# Altium schematic sheet 2V_AUX.SchDoc
size A4; SheetNumber: 6; SheetTotal: 8
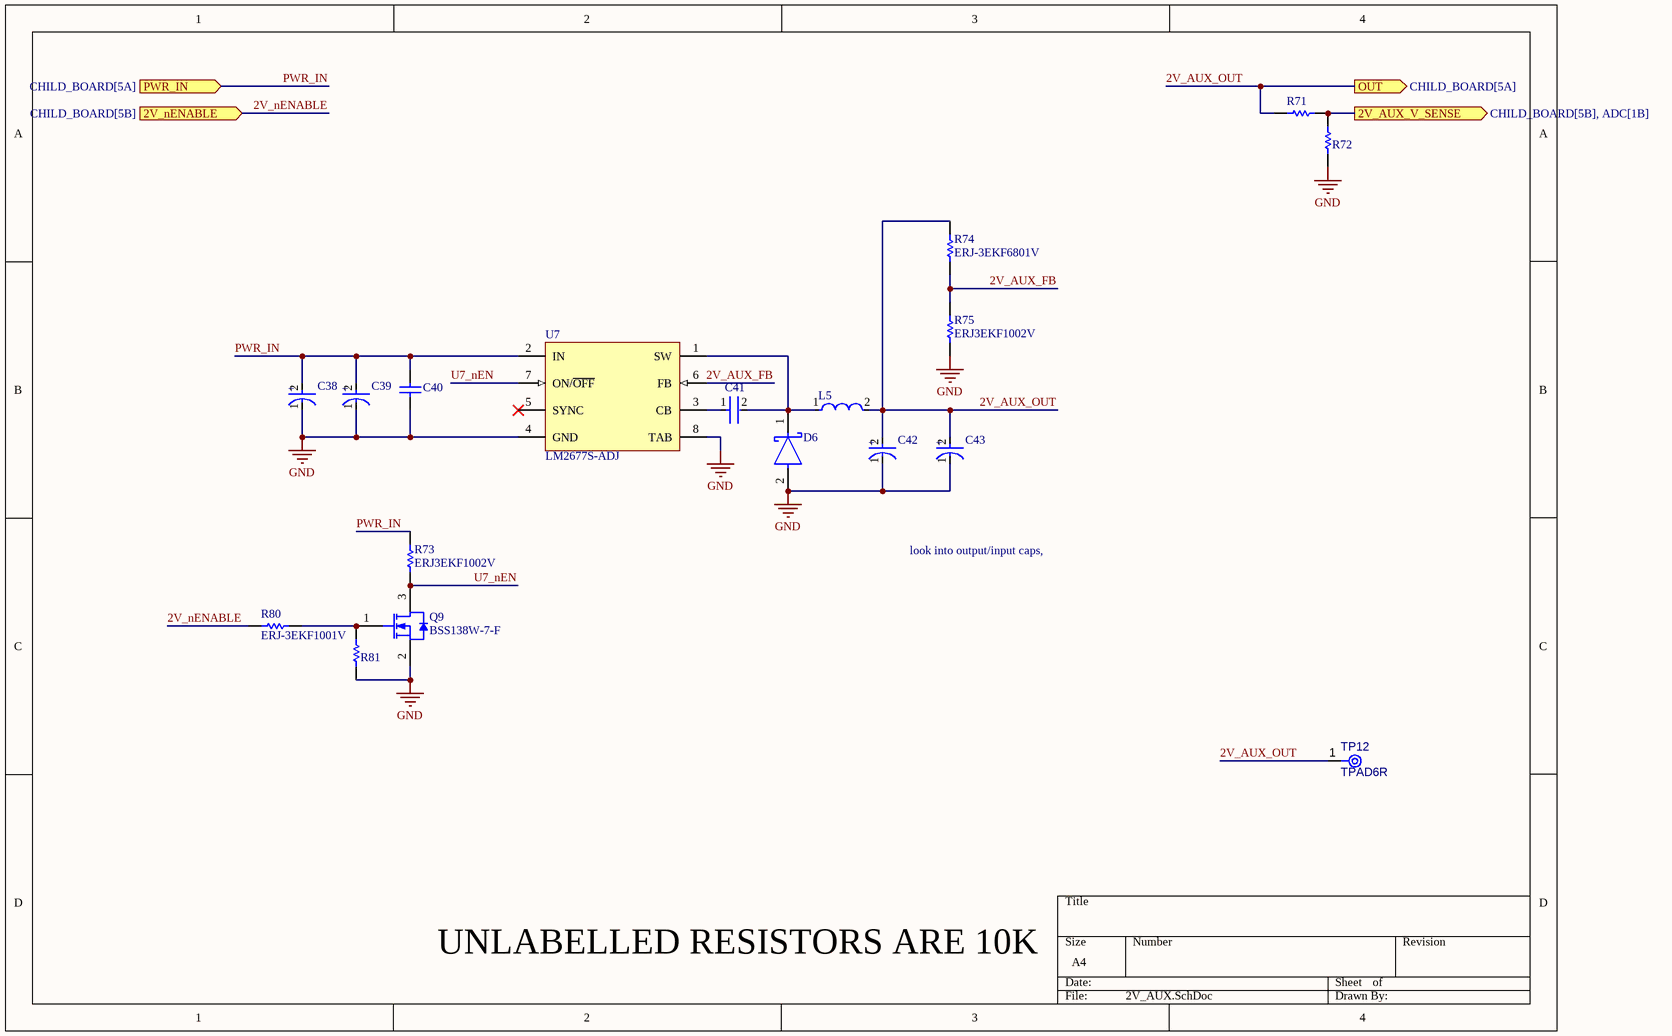
[diagram p0: 2V_AUX.SchDoc]

## Parts
C38  EEHZA1V680XP  [FP-EEH-D8-MFG]  (value not drawn)
C39  EEHZA1V680XP  [FP-EEH-D8-MFG]  (value not drawn)
C40  CAP 470nF 50V 1812(4532)  [CAPC1812(4532)125_M]  (value not drawn)
C41  C0805C103J5RACTU  [FP-C0805C-DN-MFG]  (value not drawn)
C42  16SVPC120M  [FP-OS-CON-SMT-E7-MFG]  (value not drawn)
C43  16SVPC120M  [FP-OS-CON-SMT-E7-MFG]  (value not drawn)
D6  B540C-13-F  [FP-SMC-MFG]  (value not drawn)
L5  SRR1260-150M  [FP-SRR1260-MFG]  (value not drawn)
Q9  BSS138W-7-F  [DIOD-SOT323-3_V]
R71  ERJ3EKF1002V  [RESC1609X55X30LL15T15]  (value not drawn)
R72  ERJ3EKF1002V  [RESC1609X55X30LL15T15]  (value not drawn)
R73  ERJ3EKF1002V  [RESC1609X55X30LL15T15]
R74  ERJ-3EKF6801V  [RESC1609X55X30NL15T15]
R75  ERJ3EKF1002V  [RESC1609X55X30LL15T15]
R80  ERJ-3EKF1001V  [RESC1608X55X30LL15T15]
R81  ERJ3EKF1002V  [RESC1609X55X30LL15T15]  (value not drawn)
TP12  TPAD6R  [TP06R]  (no BOM)
U7  LM2677S-ADJ  [KTW0007B_M]

## Ports
2V_AUX_V_SENSE (out, see CHILD_BOARD[5B], ADC[1B]), 2V_nENABLE (in, see CHILD_BOARD[5B]), OUT (out, see CHILD_BOARD[5A]), PWR_IN (in, see CHILD_BOARD[5A])

## Nets
GND: C38.1(C) C39.1(C) C40.1 C42.1(C) C43.1(C) D6.2(A) Q9.2(S) R72.1 R75.1 R81.1 U7.4(GND) U7.8(TAB)
2V_AUX_FB: R74.1 R75.2 U7.6(FB)
2V_AUX_OUT: C42.2(A) C43.2(A) L5.2 R71.1 R74.2 TP12.1(TP) ; port OUT
2V_AUX_V_SENSE: R71.2 R72.2 ; port 2V_AUX_V_SENSE
2V_nENABLE: R80.1 ; port 2V_nENABLE
PWR_IN: C38.2(A) C39.2(A) C40.2 R73.2 U7.2(IN) ; port PWR_IN
U7_nEN: Q9.3(D) R73.1 U7.7(ON/~{OFF})
NetC41_1: C41.1 U7.3(CB)
NetC41_2: C41.2 D6.1(C) L5.1 U7.1(SW)
NetQ9_1: Q9.1(G) R80.2 R81.2

Not connected (* = marked no-connect by the designer): U7 5(SYNC)*

## Notes on the sheet
- look into output/input caps,
- UNLABELLED RESISTORS ARE 10K
- (in symbol CMP-05428-000021-2) +
- (in symbol CMP-05428-001211-1) +

## Library data of the parts
C38 C39 = CMP-05428-001211-1: Conductive Polymer Hybrid Aluminum Electrolytic Capacitors 68uF ±20% 35V RADIAL SMT 6.3x7.7mm; Leakage Current: 23.8uA; Ripple Current (AC): 2A; Polarity: Polar; Life (Hours): 5000Hour; ESR (Equivalent Series Resistance): 35mR; Lead Diameter: 0.65mm; Termination: SMD/SMT; Case/Package: Radial; Package Quantity: 900; Radiation Hardening: No; Max Operating Temperature: 105°C; Capacitance: 68uF; Voltage Rating: 35V; Number of Pins: 8; Mount: Surface Mount; Technology: HYBRID; Diameter: 6.3mm; Min Operating Temperature: -55°C; Length: 7.7mm; Ratings: AEC-Q200; Height - Seated (Max): 0.315inch; Ripple Current: 2A; Lead Free: Lead Free; Voltage: 35V; Lead Pitch: 1.8mm; Voltage Rating (DC): 35V; REACH SVHC: No SVHC; Material: Polymer; Height: 7.7mm; Tolerance: 20%; Construction: Cylindrical; Packaging: Tape and Reel; Series: ZA
C40 = CMP-1040-01539-1: CAP 470nF 50V ±10% 1812 (4532 Metric) Thickness 1.25mm SMD; Tolerance: Â±10%; Case-Metric: 4532; Case-EIA: 1812; Technology: SMT; Max Thickness: 1.25 mm; Value: 470nF; Rated Voltage: 50 V
C41 = CMP-2007-00254-2: CAP CER 10000PF 50V X7R 0805; Manufacturer: KEMET; Value: 10,000 pF; Material: Ceramic; Temperature Coefficient: 30ppm/°C; Tolerance: 0.05; Device Class L1: Passive Components; Temperature: -55°C to +125°C; Lead Free: Yes; ComponentLink2URL: https://content.kemet.com/datasheets/KEM_C1003_C0G_SMD.pdf; Device Class L3: Ceramic Capacitors; Temperature Characteristic: X7R; Temperature Range High: +125°C; Mouser Description: Capacitor; Ceramic; Cap 0.01uF; Tol 5%; Vol-Rtg 50 V; SMT; Case 0805; X7R; TR; ComponentLink2Description: Datasheet; Manufacturer Part Number: C0805C103J5RACTU; Height: 0.88mm; Digikey Description: CAP CER 10000PF 50V X7R 0805; Capacitance: 10,000 pF; Temperature Range Low: -55°C; Device Class L2: Capacitors; Octopart: https://octopart.com/c0805c103j5ractu-kemet-133473; Voltage Rating: 50 V; Category: Cap; RoHS: TRUE; Automotive: No; Package: C0805C-DN; Ipc Land Pattern Name: CAPC200125X78
C42 C43 = CMP-05428-000021-2: Conductive Polymer Aluminum Solid Capacitors (OS-CON) 120uF ±20% 16V RADIAL SMT 8x6.9mm; Leakage Current: 500uA; Ripple Current: 2.9A; ESR (Equivalent Series Resistance): 27mR; Polarity: Polar; Dissipation Factor: 12%; Life (Hours): 2000Hour; Lead Free: Lead Free; Voltage Rating (DC): 16V; Min Operating Temperature: -55°C; Height - Seated (Max): 0.276inch; Case/Package: Radial; REACH SVHC: No SVHC; Diameter: 8mm; Mount: Surface Mount; Package Quantity: 1000; Construction: Cylindrical; Max Operating Temperature: 105°C; Capacitance: 120uF; Voltage: 16V; Length: 6.9mm; Tolerance: 20%; RoHS Compliant: Yes; Series: OS-CON, SVPC; Packaging: Tape and Reel; Voltage Rating: 16V; Termination: SMD/SMT; Number of Pins: 7; Ripple Current (AC): 2.9A; Height: 6.9mm
D6 = CMP-2000-05097-3: DIODE SCHOTTKY 40V 5A SMC; Manufacturer: Diodes Inc.; Automotive Grade: NA; Peak Reverse Current: 0.5mA; Value: 300pF; Max Junction Temp: +150°C; Max Surge Forward Current: 100A; Standoff Height: 0.1mm; Digikey Description: DIODE SCHOTTKY 40V 5A SMC; Temperature Range Low: -55°C; Manufacturer Part Number: B540C-13-F; Octopart: https://octopart.com/b540c-13-f-diodes+inc.-325873; Lead Free: Yes; Reverse Voltage: 40V; RoHS: TRUE; Category: Diode; Mouser Description: Diode: Schottky rectifying; SMD; 40V; 5A; SMC; Package: reel, tape; ComponentLink2Description: Datasheet; Temperature Range High: +150°C; Automotive: No; Footprint Url: https://www.diodes.com/assets/Package-Files/SMC.pdf; Device Class L3: Schottky Diodes; Height: 2.5mm; Forward Current: 5A; Temperature: -55°C to +150°C; Package: SMC; ComponentLink2URL: https://www.diodes.com/assets/Datasheets/ds13012.pdf; Device Class L2: Diodes; Max Repetitive Reverse Voltage: 40V; Device Class L1: Discrete Semiconductors; Capacitance: 300pF
L5 = CMP-2000-07146-2: FIXED IND 15UH 5A 27 MOHM SMD; Q Factor: 25; Sample Rate (Hz): 100kHz; Resistance: 27MR; Material: Steel; Inductance Tolerance: 20%; Frequency: 17.6MHz; Saturation Current: 4.6A; Core Material: Ferrite; Shielding: Shielded; Series: SRR1260; Termination: SMD/SMT; Packaging: Tape and Reel; RoHS Compliant: Yes; Height - Seated (Max): 0.256inch; Depth: 12.8mm; Case/Package: 1260; Inductance: 15uH; Height: 6mm; Number of Pins: 2; Mount: Surface Mount; Min Operating Temperature: -40°C; Test Frequency: 100kHz; Length: 12.5mm; Self Resonant Frequency: 17.6MHz; Current Rating: 5A; Tolerance: 20%; RMS Current (Irms): 5A; REACH SVHC: No SVHC; Resistor Type: Wirewound; DC Resistance (DCR): 27mR; Width: 12.5mm; Package Quantity: 600; DC Current: 5A; Max DC Current: 5A; Max Operating Temperature: 125°C; Military Standard: Not
Q9 = CMP-2000-05968-1: N-Channel Enhancement Mode Mosfet, 50 V, 200 mA, -55 to 150 degC, 6-Pin SOT-323, RoHS, Tape and Reel; Typical Turn-Off Delay Time: 20ns; Number of Channels: 1Channel; Type: EnhancementModeFieldEffectTransistor; Brand: DiodesIncorporated; Vds - Drain-Source Breakdown Voltage: 75V; Vgs - Gate-Source Voltage: 20V; Rds On - Drain-Source Resistance: 1.4Ohms; Transistor Type: 1N-Channel; Configuration: Single; Unit Weight: 0.000212oz; Pd - Power Dissipation: 200mW; Id - Continuous Drain Current: 200mA; Forward Transconductance - Min: 0.1S; Manufacturer URL: http://www.diodes.com/; Series: BSS138; Package Description: 3-Pin Small Outline Transistor, Body 2 x 1.25 mm, Pitch 0.65 mm; Mounting Technology: SurfaceMount; Product Category: MOSFET; RoHS: True; Maximum Operating Temperature: +150C; Height: 1mm; Length: 2.2mm; Technology: Si; Width: 1.35mm; Datasheet URL: http://www.diodes.com/_files/datasheets/ds30206.pdf; Manufacturer: DiodesIncorporated; Package / Case: SOT-323-3; Typical Turn-On Delay Time: 20ns; Transistor Polarity: N-Channel; Factory Pack Quantity: 3000; Packaging: Reel; Product: MOSFETSmallSignal; Datasheet Version: Rev. 11-2, 09/2013; Package Reference: SOT323; Minimum Operating Temperature: -55C; Mounting Style: SMD/SMT; Channel Mode: Enhancement
R71-R73 R75 R81 = CMP-1012-00623-3: Chip Resistor, 10 KOhm, +/- 1%, 0.1 W, -55 to 155 degC, 0603 (1608 Metric), RoHS, Tape and Reel; Manufacturer: Panasonic; Voltage Rating: 75V; Case\/Package: 0603; Power Rating: 100mW; Resistance: 10KOhm; Temperature Coefficient: 100ppm\/degreesC; Number of Pins: 2; Package Reference: 603; Depth: 0.8mm; Mount: SurfaceMount; Package Description: 2-Pin Surface Mount Device, Body 1.6 x 0.85 mm; Datasheet Version: 02/2017; Length: 1.6mm; Lead Free: LeadFree; Height: 0.45mm; Number of Terminations: 2; Max Power Dissipation: 100mW; Min Operating Temperature: -55degC; Datasheet URL: https://industrial.panasonic.com/cdbs/www-data/pdf/RDA0000/AOA0000C304.pdf; Termination: SMD/SMT; Case Code (Metric): 1608; Case Code (Imperial): 0603; Tolerance: 1%; Max Operating Temperature: 155degC; RoHSCompliant: true; Voltage Rating (DC): 75V; Radiation Hardening: No; Packaging: TapeandReel; Composition: ThickFilm; Mounting Technology: SurfaceMount; Manufacturer URL: http://www.panasonic.com/; Width: 0.031inch; REACH SVHC: NoSVHC; Contact Plating: Tin; Military Standard: Not; Package Quantity: 1
R74 = CMP-1012-00604-3: Chip Resistor, 6.8 KOhm, +/- 1%, 0.1 W, -55 to 155 degC, 0603 (1608 Metric), RoHS, Tape and Reel; Frequency: 48 MHz; Min Supply Voltage: 1.71 V; I\Os: 50; Max Supply Voltage: 3.6 V; Interface: UART; Density: 128 KB; RAM Size: 16 KB; PWM Channels: 6; ADC Channels: 14; Case\Package: LQFP; PackageDescription: 2-Pin Surface Mount Device, Body 1.6 x 0.85 mm; Max Operating Temperature: 105 degC; Package Quantity: 160; ComponentLink2Description: Datasheet; Max Clock Frequency: 48 MHz; ComponentLink1URL: http://www.panasonic.com/; REACH SVHC: No SVHC; Min Operating Temperature: -40 degC; Weight: 0.012224 oz; ComponentLink2URL: http://industrial.panasonic.com/cdbs/www-data/pdf/RDA0000/AOA0000C86.pdf; ComponentLink1Description: Manufacturer URL; Pins: 64; DatasheetVersion: Apr-15; RoHSCompliant: true; PackageReference: 0603; Packaging: Tray; Length: 10 mm; Radiation Hardening: No; Mount: Surface Mount; Width: 10 mm; Height: 1.45 mm
R80 = CMP-2000-00180-1: Manufacturer: Panasonic; Part Number: ERJ-3EKF1001V
TP12 = CMP-00028-00002-2: 0.6mm round; Pins: 1
U7 = CMP-0069-00211-3: SIMPLE SWITCHER® High Efficiency 5A Step-Down Voltage Regulator with Sync, 7-pin TO-263; Manufacturer: Texas Instruments; PackageTopMarking: NSUZXYTTE#*LM2677S*-ADJ; PowerWise: N; PinCount: 7; CompType: Switcher; ComponentLink1Description: Datasheet URL; PackageReference: KTW0007B; Code_JEDEC: MO-169-AC; ComponentLink1URL: http://www.ti.com/general/docs/lit/getliterature.tsp?genericPartNumber=LM2677&fileType=pdf; PackageDescription: TO-263, Molded, .400 x .390 x .180in Body, 7 Lead, .050in Pitch, Surface Mount; RoHS: N